# Altium project car.PrjPcb
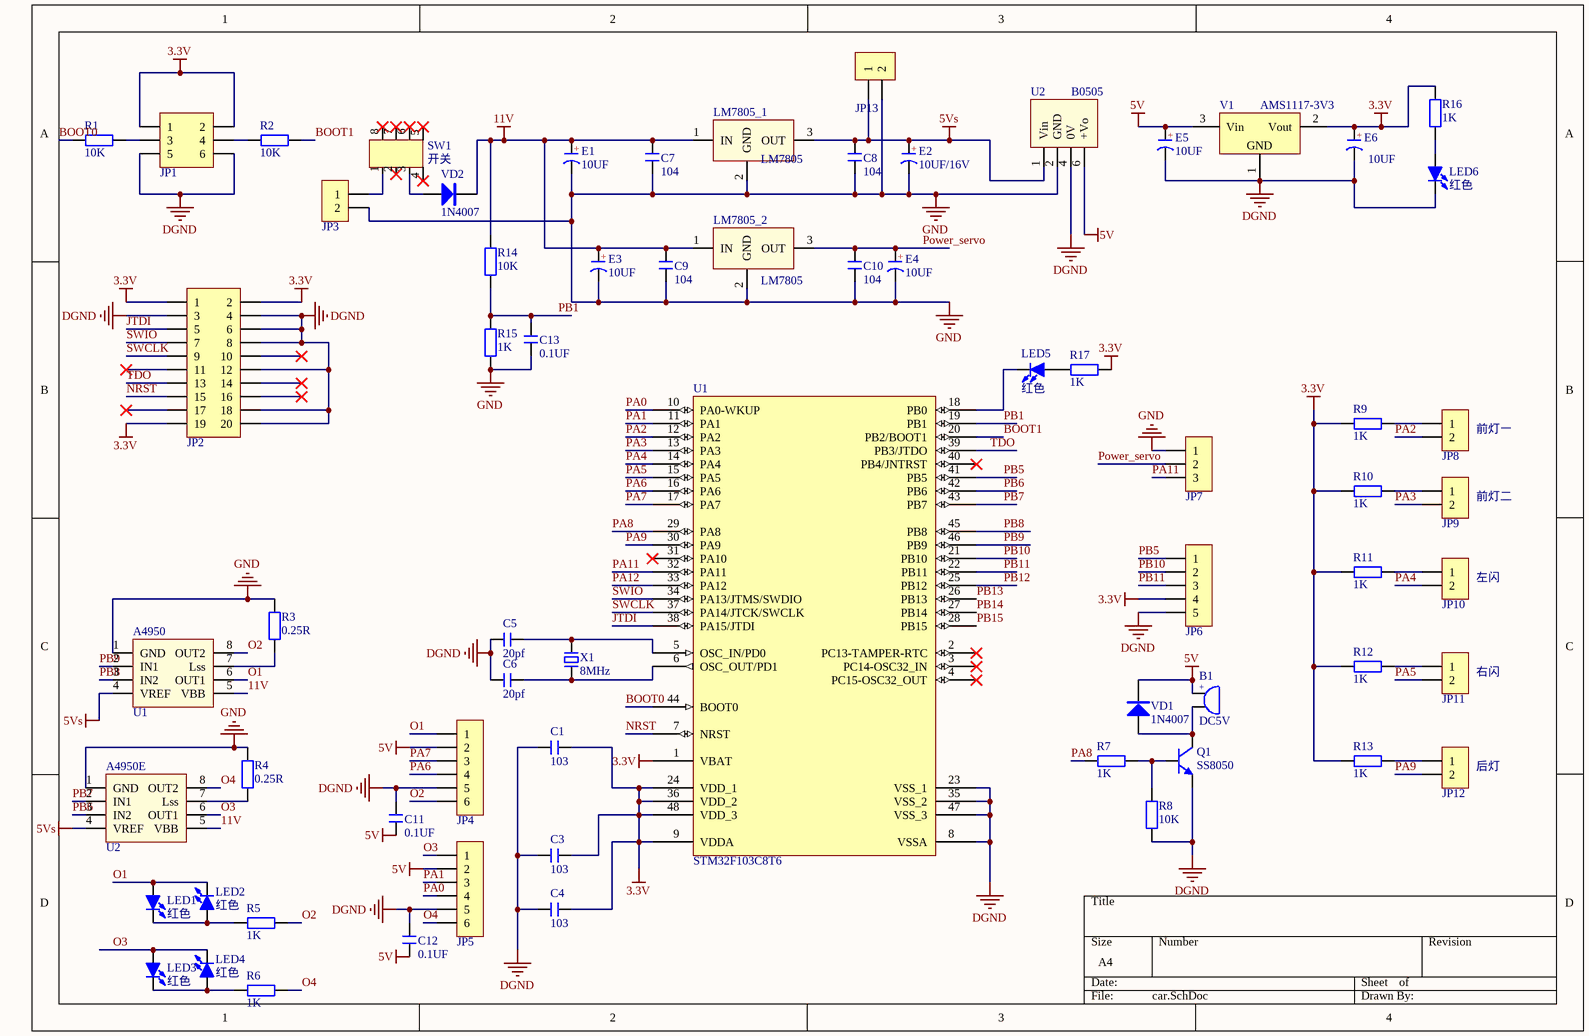
[diagram p0: car.SchDoc]
1 sheet, 67 parts. Net scope: global (net labels, ports and power ports of the same name join across sheets).
Board file: car.PcbDoc

## Sheet car.SchDoc
size A4

### Parts
A4950  U1  [LC-SOIC-8_EP_150mil]
A4950E  U2  [LC-SOIC-8_EP_150mil]
B1  DC5V  [BEEP 7.6X12X9.5]
C1  103  [C 0805]
C3  103  [C 0805]
C4  103  [C 0805]
C5  20pf  [C 0805]
C6  20pf  [C 0805]
C7  104  [C 0805]
C8  104  [C 0805]
C9  104  [C 0805]
C10  104  [C 0805]
C11  0.1UF  [C 0805]
C12  0.1UF  [C 0805]
C13  0.1UF  [C 0805]
E1  10UF  [CAP 2.5*5*11]
E2  10UF/16V  [CAP 2.5*5*11]
E3  10UF  [CAP 2.5*5*11]
E4  10UF  [CAP 2.5*5*11]
E5  10UF  [CS 2.0*5*8 - C]
E6  10UF  [CS 2.0*5*8 - C]
JP1  Header3X2  [HDR-3X2]  (value not drawn)
JP2  Header 2X10  [IDC2.54-20P]  (value not drawn)
JP3  HDR-1X2  [HDR-1X2]  (value not drawn)
JP4  HDR-1X6  [XH2.54-6P_H]  (value not drawn)
JP5  HDR-1X6  [XH2.54-6P_H]  (value not drawn)
JP6  HDR-1X5  [HDR-1X5]  (value not drawn)
JP7  HDR-1X3  [HDR-1X3]  (value not drawn)
JP8  HDR-1X2  [HDR-1X2]  (value not drawn)
JP9  HDR-1X2  [HDR-1X2]  (value not drawn)
JP10  HDR-1X2  [HDR-1X2]  (value not drawn)
JP11  HDR-1X2  [HDR-1X2]  (value not drawn)
JP12  HDR-1X2  [HDR-1X2]  (value not drawn)
JP13  HDR-1X2  [HDR-1X2]  (value not drawn)
LED1  红色  [LED 1206G]
LED2  红色  [LED 1206G]
LED3  红色  [LED 1206G]
LED4  红色  [LED 1206G]
LED5  红色  [LED 1206Y]
LED6  红色  [LED 1206G]
LM7805_1  LM7805  [LC-TO-220(TO-220-3)]
LM7805_2  LM7805  [LC-TO-220(TO-220-3)]
Q1  SS8050  [SOT23-3N]
R1  10K  [R 1206]
R2  10K  [R 1206]
R3  0.25R  [R 1206]
R4  0.25R  [R 1206]
R5  1K  [R 0805]
R6  1K  [R 0805]
R7  1K  [R 1206]
R8  10K  [R 1206]
R9  1K  [R 1206]
R10  1K  [R 1206]
R11  1K  [R 1206]
R12  1K  [R 1206]
R13  1K  [R 1206]
R14  10K  [R 1206]
R15  1K  [R 0805]
R16  1K  [R 1206]
R17  1K  [R 1206]
SW1  开关  [PCBComponent_1]
U1  STM32F103C8T6  [LQFP48 7X7_M]
U2  B0505  [B0505]
V1  AMS1117-3V3  [SOT223_L]
VD1  1N4007  [DO-41]
VD2  1N4007  [DO-41]
X1  8MHz  [XTAL-49S SMD]

### Nets
3.3V: C1.2 C3.2 C4.2 E6.1(A) JP1.1 JP1.2 JP2.1 JP2.2 JP2.19 JP6.4 R9.1 R10.1 R11.1 R12.1 R13.1 R16.2 R17.1 U1.1(VBAT) U1.9(VDDA) U1.24(VDD_1) U1.36(VDD_2) U1.48(VDD_3) V1.2(Vout)
5V: B1.1 C11.1 C12.1 E5.1(A) JP4.2 JP5.2 U2.6(+Vo) V1.3(Vin) VD1.2(K)
5Vs: A4950.4(VREF) A4950E.4(VREF) C8.2 E2.1(A) JP13.1 LM7805_1.3(OUT) U2.1(Vin)
11V: A4950.5(VBB) A4950E.5(VBB) C7.2 C9.2 E1.1(A) E3.1(A) LM7805_1.1(IN) LM7805_2.1(IN) R14.2 VD2.2(K)
DGND: C1.1 C3.1 C4.1 C5.1 C6.1 C11.2 C12.2 E5.2(K) E6.2(K) JP1.5 JP1.6 JP2.3 JP2.4 JP2.6 JP2.8 JP2.12 JP2.18 JP2.20 JP4.5 JP5.5 JP6.5 LED6.2(K) Q1.2(E) R8.1 U1.8(VSSA) U1.23(VSS_1) U1.35(VSS_2) U1.47(VSS_3) U2.4(0V) V1.1(GND)
GND: A4950.1(GND) A4950E.1(GND) C7.1 C8.1 C9.1 C10.1 C13.1 E1.2(K) E2.2(K) E3.2(K) E4.2(K) JP3.2 JP7.1 JP13.2 LM7805_1.2(GND) LM7805_2.2(GND) R3.2 R4.2 R15.2 U2.2(GND)
BOOT0: R1.1 U1.44(BOOT0)
BOOT1: R2.2 U1.20(PB2/BOOT1)
JTDI: JP2.5 U1.38(PA15/JTDI)
NRST: JP2.15 U1.7(NRST)
O1: A4950.6(OUT1) JP4.1 LED1.1(A) LED2.2(K)
O2: A4950.8(OUT2) JP4.6 R5.2
O3: A4950E.6(OUT1) JP5.1 LED3.1(A) LED4.2(K)
O4: A4950E.8(OUT2) JP5.6 R6.2
PA0: JP5.4 U1.10(PA0-WKUP)
PA1: JP5.3 U1.11(PA1)
PA2: JP8.2 U1.12(PA2)
PA3: JP9.2 U1.13(PA3)
PA4: JP10.2 U1.14(PA4)
PA5: JP11.2 U1.15(PA5)
PA6: JP4.4 U1.16(PA6)
PA7: JP4.3 U1.17(PA7)
PA8: R7.1 U1.29(PA8)
PA9: JP12.2 U1.30(PA9)
PA11: JP7.3 U1.32(PA11)
PA12: U1.33(PA12)
PB1: C13.2 R14.1 R15.1 U1.19(PB1)
PB5: JP6.1 U1.41(PB5)
PB6: A4950E.3(IN2) U1.42(PB6)
PB7: A4950E.2(IN1) U1.43(PB7)
PB8: A4950.3(IN2) U1.45(PB8)
PB9: A4950.2(IN1) U1.46(PB9)
PB10: JP6.2 U1.21(PB10)
PB11: JP6.3 U1.22(PB11)
PB12: U1.25(PB12)
PB13: U1.26(PB13)
PB14: U1.27(PB14)
PB15: U1.28(PB15)
Power_servo: C10.2 E4.1(A) JP7.2 LM7805_2.3(OUT)
SWCLK: JP2.9 U1.37(PA14/JTCK/SWCLK)
SWIO: JP2.7 U1.34(PA13/JTMS/SWDIO)
TDO: JP2.13 U1.39(PB3/JTDO)
NetA4950_7: A4950.7(Lss) R3.1
NetA4950E_7: A4950E.7(Lss) R4.1
NetB1_2: B1.2 Q1.3(C) VD1.1(A)
NetC5_2: C5.2 U1.5(OSC_IN/PD0) X1.2
NetC6_2: C6.2 U1.6(OSC_OUT/PD1) X1.1
NetJP1_3: JP1.3 R1.2
NetJP1_4: JP1.4 R2.1
NetJP3_1: JP3.1 SW1.1
NetJP8_1: JP8.1 R9.2
NetJP9_1: JP9.1 R10.2
NetJP10_1: JP10.1 R11.2
NetJP11_1: JP11.1 R12.2
NetJP12_1: JP12.1 R13.2
NetLED1_2: LED1.2(K) LED2.1(A) R5.1
NetLED3_2: LED3.2(K) LED4.1(A) R6.1
NetLED5_1: LED5.1(A) R17.2
NetLED5_2: LED5.2(K) U1.18(PB0)
NetLED6_1: LED6.1(A) R16.1
NetQ1_1: Q1.1(B) R7.2 R8.2
NetSW1_3: SW1.3 VD2.1(A)

Not connected (* = marked no-connect by the designer): JP2 10* 11* 14* 16* 17*; SW1 2* 4* 5* 6* 7* 8*; U1 2(PC13-TAMPER-RTC)* 3(PC14-OSC32_IN)* 4(PC15-OSC32_OUT)* 31(PA10)* 40(PB4/JNTRST)*

### Notes on the sheet
- (near JP8) 前灯一
- (near JP9) 前灯二
- (near JP10) 左闪
- (near JP11) 右闪
- (near JP12) 后灯
- (in symbol BEEP) +
- (in symbol C-CAP) +
- (in symbol C-CS) +

### Library data of the parts
A4950 A4950E = A4950
B1 = BEEP: 蜂鸣器; 版权归属: 源创客; BOM名称: 蜂鸣器; 学习资源: www.ooocke.com
C1 C3-C13 = C: 无极性贴片电容; 版权归属: 源创客; BOM名称: 无极性贴片电容; 学习资源: www.ooocke.com
E1-E4 = C-CAP: 直插电解电容; 版权归属: 源创客; BOM名称: 直插电解电容; 学习资源: www.ooocke.com
E5 E6 = C-CS: 直插固态电容; 版权归属: 源创客; BOM名称: 直插固态电容; 学习资源: www.ooocke.com
JP1 = Header 3X2: 3*2P接插件; 版权归属: 源创客; BOM名称: 3*2P接插件; 学习资源: www.ooocke.com
JP2 = Header 10X2: 10*2P接插件; 版权归属: 源创客; BOM名称: 10*2P接插件; 学习资源: www.ooocke.com
JP3 JP8-JP13 = Header 2: 2P接插件; 版权归属: 源创客; BOM名称: 2P接插件; 学习资源: www.ooocke.com
JP4 JP5 = Header 6: 6P接插件; 版权归属: 源创客; BOM名称: 6P接插件; 学习资源: www.ooocke.com
JP6 = Header 5: 5P接插件; 版权归属: 源创客; BOM名称: 5P接插件; 学习资源: www.ooocke.com
JP7 = Header 3: 3P接插件; 版权归属: 源创客; BOM名称: 3P接插件; 学习资源: www.ooocke.com
LED1-LED6 = LED-SMD: 贴片LED; 版权归属: 源创客; BOM名称: 贴片LED; 学习资源: www.ooocke.com
Q1 = 8050-SMD: 高频放大-NPN型; 版权归属: 源创客; 属性: 40V 1.5A 1W 100MHZ; BOM名称: 高频放大-NPN型; 学习资源: www.ooocke.com
R1-R17 = R: 贴片电阻; 版权归属: 源创客; BOM名称: 贴片电阻; 学习资源: www.ooocke.com
U1 = STM32F103C8T6: Flaah:64/RAM:20/IO:36; BOM名称: 32位STM单片机; 版权归属: 源创客; 学习资源: www.ooocke.com
V1 = AMS1117: 三端稳压芯片; BOM名称: 稳压芯片; 版权归属: 源创客; 学习资源: www.ooocke.com
VD1 VD2 = 1N4007: 整流二极管; 版权归属: 源创客; BOM名称: 整流二极管; 学习资源: www.ooocke.com
X1 = XTAL-2: 2脚晶振; 版权归属: 源创客; BOM名称: 2脚晶振; 学习资源: www.ooocke.com